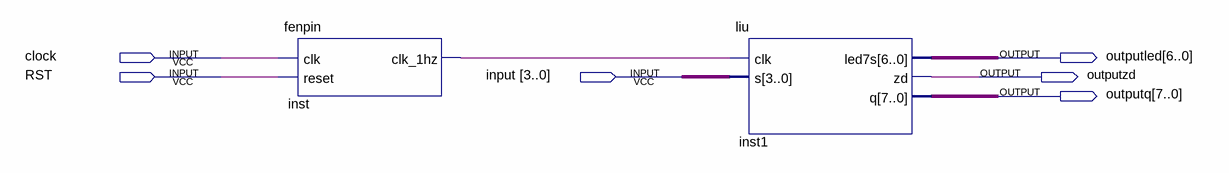
[diagram p0: schematic sheet]
// Quartus schematic Block2.bdf as structural Verilog: 2 symbols, 6 pins
module Block2 (
  input  clock,
  input  RST,
  input  [3:0] \input ,
  output [6:0] outputled,
  output outputzd,
  output [7:0] outputq
);

  wire inst_clk_1hz;

  fenpin inst (.clk(clock), .reset(RST), .clk_1hz(inst_clk_1hz));
  liu inst1 (.clk(inst_clk_1hz), .s(\input ), .led7s(outputled), .zd(outputzd), .q(outputq));
endmodule
